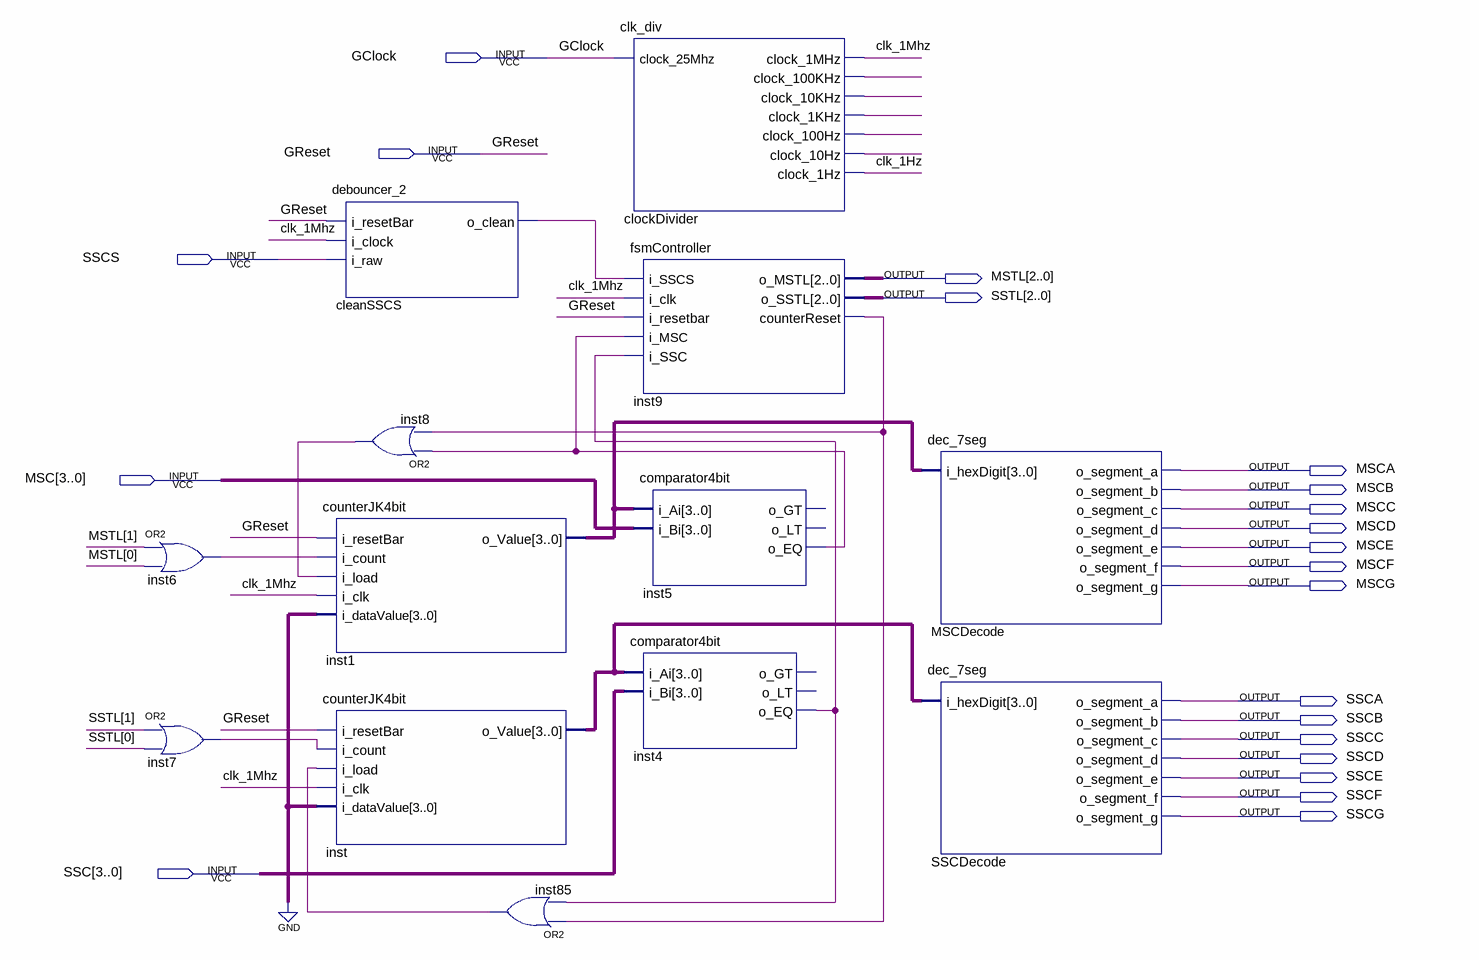
[diagram p0: schematic sheet]
// Quartus schematic lab3 backup.bdf as structural Verilog: 13 symbols, 21 pins
module \lab3_backup  (
  input  GClock,
  input  GReset,
  input  SSCS,
  input  [3:0] MSC,
  input  [3:0] SSC,
  output [2:0] MSTL,
  output [2:0] SSTL,
  output MSCA,
  output MSCB,
  output MSCC,
  output MSCD,
  output MSCE,
  output MSCF,
  output MSCG,
  output SSCA,
  output SSCB,
  output SSCC,
  output SSCD,
  output SSCE,
  output SSCF,
  output SSCG
);

  wire cleanSSCS_o_clean, clk_1Hz, clk_1Mhz, clockDivider_clock_1khz, clockDivider_clock_10hz,
       clockDivider_clock_10khz, clockDivider_clock_100hz, clockDivider_clock_100khz, inst4_o_eq, inst5_o_eq,
       inst6_out, inst7_out, inst8_out, inst9_counterreset, inst85_out;
  wire [3:0] inst1_o_value, inst_o_value;

  or inst6 (inst6_out, MSTL[1], MSTL[0]);
  or inst7 (inst7_out, SSTL[1], SSTL[0]);
  debouncer_2 cleanSSCS (.i_resetBar(GReset), .i_clock(clk_1Mhz), .i_raw(SSCS), .o_clean(cleanSSCS_o_clean));
  or inst8 (inst8_out, inst5_o_eq, inst9_counterreset);
  counterJK4bit inst1 (
    .i_resetBar(GReset), .i_count(inst6_out), .i_load(inst8_out), .i_clk(clk_1Mhz), .i_dataValue(4'b0000),
    .o_Value(inst1_o_value));
  counterJK4bit inst (
    .i_resetBar(GReset), .i_count(inst7_out), .i_load(inst85_out), .i_clk(clk_1Mhz), .i_dataValue(4'b0000),
    .o_Value(inst_o_value));
  or inst85 (inst85_out, inst9_counterreset, inst4_o_eq);
  clk_div clockDivider (
    .clock_25Mhz(GClock), .clock_1MHz(clk_1Mhz), .clock_100KHz(clockDivider_clock_100khz),
    .clock_10KHz(clockDivider_clock_10khz), .clock_1KHz(clockDivider_clock_1khz),
    .clock_100Hz(clockDivider_clock_100hz), .clock_10Hz(clockDivider_clock_10hz), .clock_1Hz(clk_1Hz));
  fsmController inst9 (
    .i_SSCS(cleanSSCS_o_clean), .i_clk(clk_1Mhz), .i_resetbar(GReset), .i_MSC(inst5_o_eq),
    .i_SSC(inst4_o_eq), .o_MSTL(MSTL), .o_SSTL(SSTL), .counterReset(inst9_counterreset));
  comparator4bit inst5 (.i_Ai(inst1_o_value), .i_Bi(MSC), .o_EQ(inst5_o_eq));  // open: o_GT, o_LT
  comparator4bit inst4 (.i_Ai(inst_o_value), .i_Bi(SSC), .o_EQ(inst4_o_eq));  // open: o_GT, o_LT
  dec_7seg MSCDecode (
    .i_hexDigit(inst1_o_value), .o_segment_a(MSCA), .o_segment_b(MSCB), .o_segment_c(MSCC),
    .o_segment_d(MSCD), .o_segment_e(MSCE), .o_segment_f(MSCF), .o_segment_g(MSCG));
  dec_7seg SSCDecode (
    .i_hexDigit(inst_o_value), .o_segment_a(SSCA), .o_segment_b(SSCB), .o_segment_c(SSCC),
    .o_segment_d(SSCD), .o_segment_e(SSCE), .o_segment_f(SSCF), .o_segment_g(SSCG));
endmodule
